# EAGLE design sensor_v9_ads (EAGLE 7.1.0)
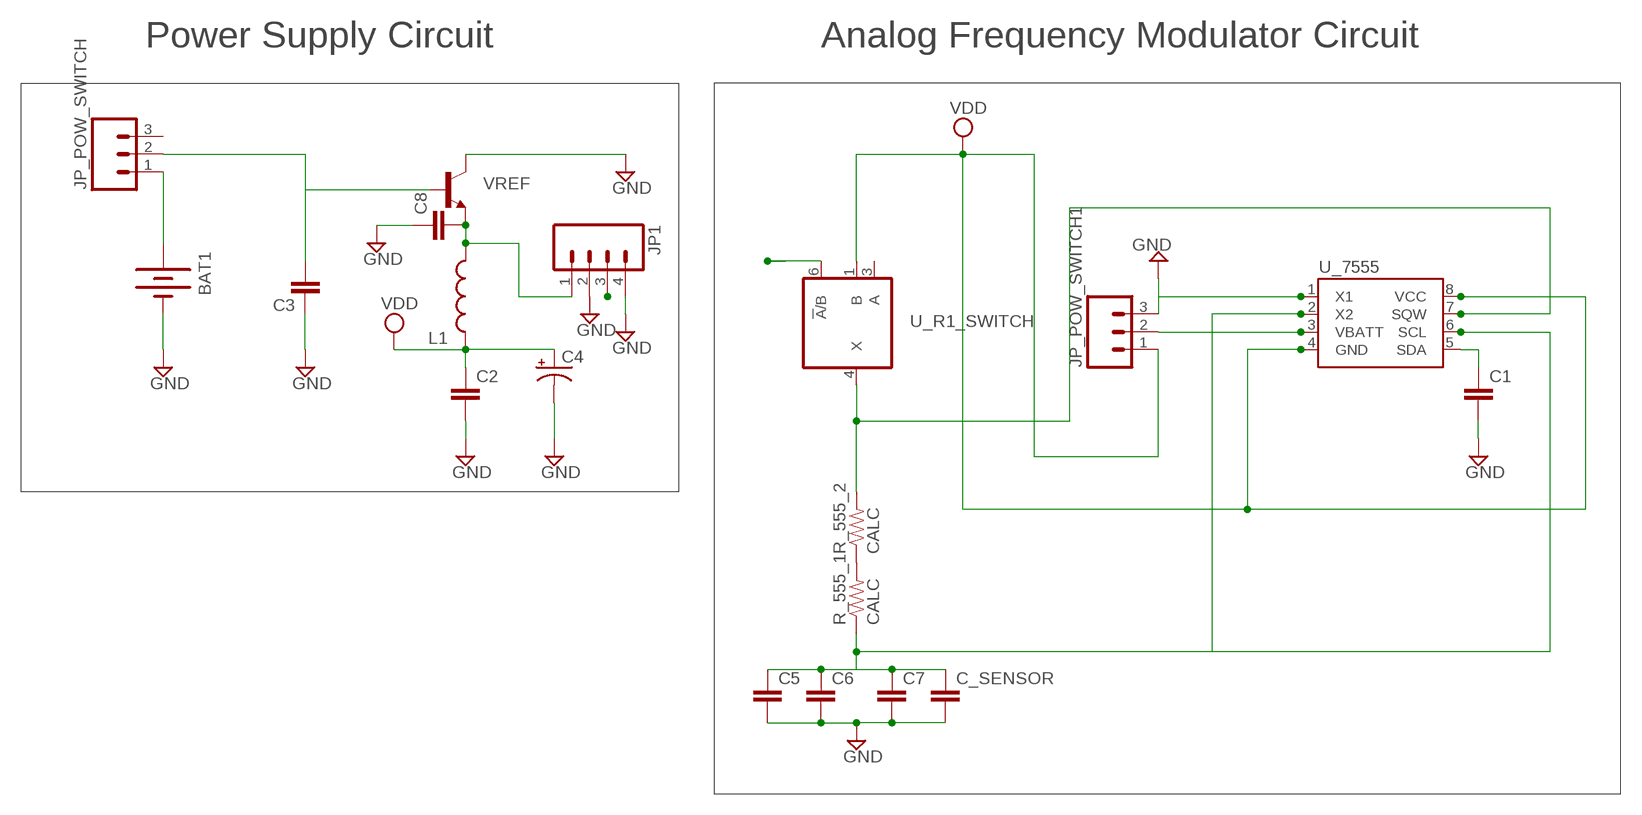
[diagram p0: schematic, sheet 1]

## Parts
BAT1  BATTERY20PTH_LAB  [BATTCOM_20MM_PTH]
C1  CAP0603-CAP  [0603-CAP]
C2  CAP0603-CAP  [0603-CAP]
C3  CAP0603-CAP  [0603-CAP]
C4  CAP_POL1206  [EIA3216]
C5  CAP0805  [0805]
C6  CAP0805  [0805]
C7  CAP0805  [0805]
C8  CAP0603-CAP  [0603-CAP]
C_SENSOR  CAP0805  [0805]
JP1  M04LOCK  [1X04_LOCK]
JP_POW_SWITCH  M03LOCK  [1X03_LOCK]
JP_POW_SWITCH1  M03LOCK  [1X03_LOCK]
L1  INDUCTOR0603  [0603]
R_555_1  CALC  RESISTOR0805-RES  [0805]
R_555_2  CALC  RESISTOR0805-RES  [0805]
U_7555  DS1307SO8  [SO08]
U_R1_SWITCH  741G3157DCKR  [DCK_R-PDSO-G6]
U_VREF  TRANSISTOR_NPNSOT23-3  [SOT23-3]

## Nets
FOUT: JP_POW_SWITCH1.2 U_7555.3(VBATT) U_R1_SWITCH.6(!A!/B)
GND: BAT1.2(-) C1.2 C2.2 C3.1 C4.C(-) C5.2 C6.2 C7.2 C8.1 C_SENSOR.2 JP1.2 JP1.4 JP_POW_SWITCH1.3 U_7555.1(X1) U_VREF.3(C)
N$6: BAT1.1(+) JP1.3 JP_POW_SWITCH.1
N$9: R_555_1.2 R_555_2.1
P2: C5.1 C6.1 C7.1 C_SENSOR.1 R_555_1.1 U_7555.2(X2) U_7555.6(SCL)
P5: C1.1 U_7555.5(SDA)
P7: R_555_2.2 U_7555.7(SQW) U_R1_SWITCH.4(X)
VDD: C2.1 C4.A(+) JP_POW_SWITCH1.1 L1.1 U_7555.4(GND) U_7555.8(VCC) U_R1_SWITCH.1(B)
VREFIN: C3.2 JP_POW_SWITCH.2 U_VREF.1(B)
VREFOUT: C8.2 JP1.1 L1.2 U_VREF.2(E)
Unconnected: JP_POW_SWITCH.3 U_R1_SWITCH.3(A)

## Notes on the sheet
- Power Supply Circuit | Analog Frequency Modulator Circuit
- VREF

## Power pins joined to a net without a drawn wire
GND: U_R1_SWITCH.2(GND)
VCC: U_R1_SWITCH.5(VCC)

## Library data of the parts
BAT1 = semipassiveTag_library:BATTERY: Battery Holders Various common sizes : AA, AAA, 20mm coin cell and 12mm coin cell.
C1-C3 C8 = SparkFun-Capacitors:CAP: Capacitor Standard 0603 ceramic capacitor, and 0.1" leaded capacitor.
C4 = SparkFun-Capacitors:CAP_POL: Capacitor Polarized These are standard SMD and PTH capacitors. Normally 10uF, 47uF, and 100uF in electrolytic and tantalum varieties. Always verify the external diameter of the through hole cap, it varies with capacity, voltage, and manufacturer. The EIA devices should be standard.
C5-C7 C_SENSOR = SparkFun:CAP: Capacitor Standard 0603 ceramic capacitor, and 0.1" leaded capacitor.
JP1 = SparkFun-Connectors:M04: Header 4 Standard 4-pin 0.1" header. Use with straight break away headers (SKU : PRT-00116), right angle break away headers (PRT-00553), swiss pins (PRT-00743), machine pins (PRT-00117), and female headers (PRT-00115). Molex polarized connector foot print use with SKU : PRT-08231 with associated crimp pins and housings. 1MM SMD Version SKU: PRT-10208
JP_POW_SWITCH JP_POW_SWITCH1 = SparkFun-Connectors:M03: Header 3 Standard 3-pin 0.1" header. Use with straight break away headers (SKU : PRT-00116), right angle break away headers (PRT-00553), swiss pins (PRT-00743), machine pins (PRT-00117), and female headers (PRT-00115). Molex polarized connector foot print use with SKU : PRT-08232 with associated crimp pins and housings.
L1 = SparkFun-Passives:INDUCTOR: Inductors Basic Inductor/Choke - 0603 and 1206. Footprints are not proven and vary greatly between part numbers.
R_555_1 R_555_2 = SparkFun-Resistors:RESISTOR: Resistor Basic schematic elements and footprints for 0603, 1206, and PTH resistors.
U_7555 = SparkFun-FreqCtrl:DS1307: I2C real-time clock with battery backup.
U_R1_SWITCH = 74xx-little-de:74*1G3157: Single-Pole, Double-Throw Analog Switch Source: http://focus.ti.com/lit/ds/symlink/sn74lvc1g3157.pdf
U_VREF = SparkFun:TRANSISTOR_NPN: Transistor NPN BJT configuration in SOT23 package. MMBT2222 is the common NPN we use. Double check BCE configuration again layout.

## Board
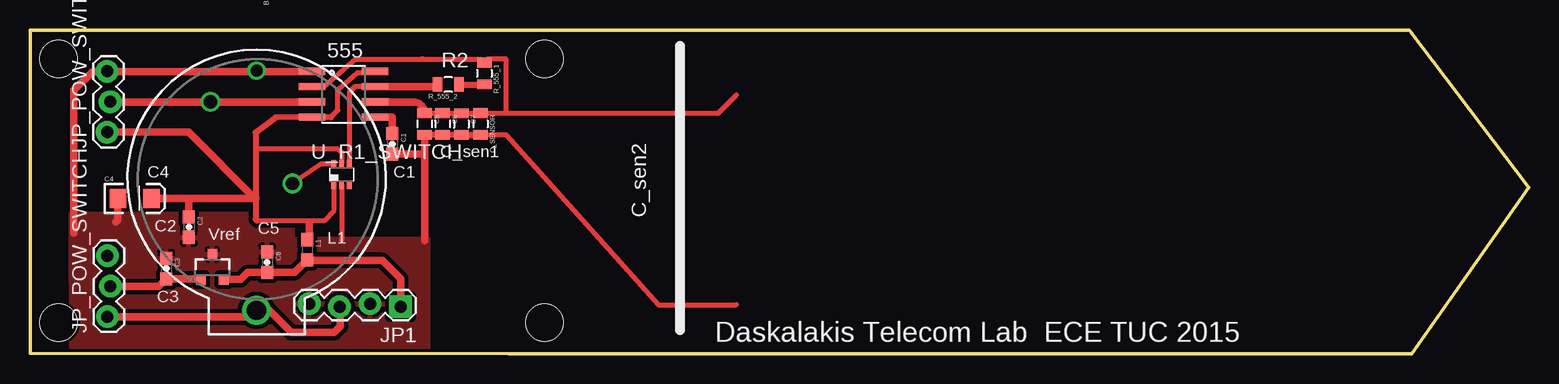
[diagram p1: board, top side]
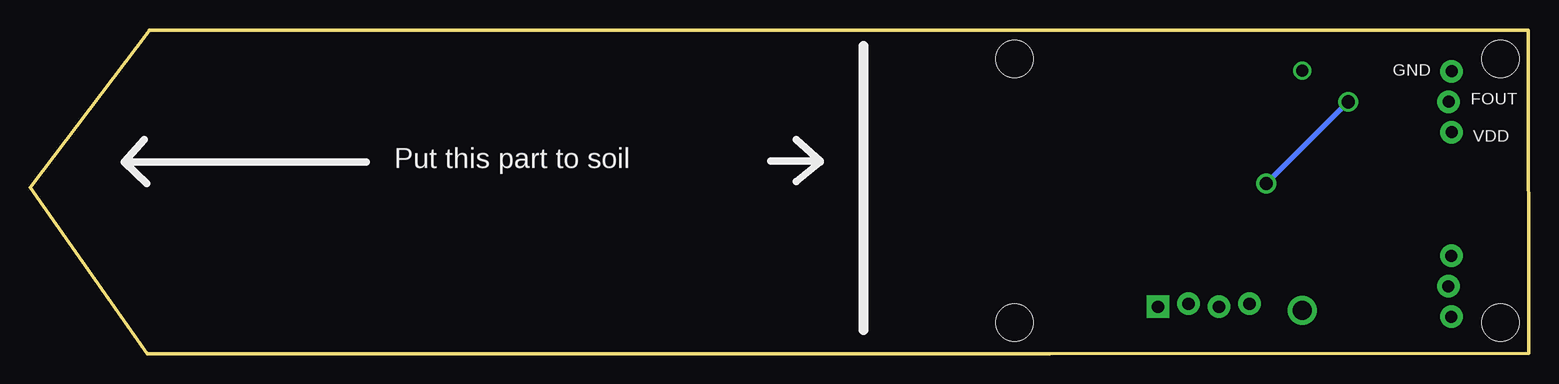
[diagram p2: board, bottom side, seen from below]

Size 124.9 x 27.03 mm. Coordinates in mm from the lower left corner, seen from the top.
Outline: 114.96,26.98 124.9,13.87 115.13,0.02
Outline: 0.03,27.02 0,0.08
Outline: 114.95,27.02 0.08,27.03
Outline: 0.02,0.05 39.9,0.01 115.04,0
Copper layers (1*16): Top 0.035mm / dielectric 1.5mm / Bottom 0.035mm
Design rules "Fusion_eagle_rule_v1.1 *": minimum track width 12mil, minimum drill 12mil, track to track 14mil, track to pad 14mil, pad to pad 14mil, via to via 14mil, smd to smd 0mil, copper to edge 10mil, drill to drill 10mil, minimum pad ring 10mil, minimum via ring 6mil, stop-mask expansion 2mil, vias tented up to drill 100mil, thermal gap 10mil
Holes 3.1 mm at 42.86,2.6 42.86,24.6 2.36,2.6 2.36,24.6

### Footprints (pad centres in the part's own frame; a part is rotated, then mirrored left to right if it is on the bottom)
BATTCOM_20MM_PTH = drill 1.6: 1 19.99,0 | drill 1: 2 0,0
0603-CAP = smd 1.1 x 1: 1 -0.85,0; 2 0.85,0
EIA3216 = smd 1.4 x 1.6: A 1.4,0; C -1.4,0
0805 = smd 0.8 x 1.2: 1 -0.9,0; 2 0.9,0
1X04_LOCK = drill 1.016 pad 1.88 square: 1 0,0.127 | drill 1.016 pad 1.88: 2 2.54,-0.127; 3 5.08,0.127; 4 7.62,-0.127
1X03_LOCK = drill 1 pad 1.88: 1 0,0.127; 2 2.54,-0.127; 3 5.08,0.127
0603 = smd 1.1 x 1: 1 -0.85,0; 2 0.85,0
SO08 = smd 0.61 x 2.21: 1 -1.905,-2.616; 2 -0.635,-2.616; 3 0.635,-2.616; 4 1.905,-2.616; 5 1.905,2.616; 6 0.635,2.616; 7 -0.635,2.616; 8 -1.905,2.616
DCK_R-PDSO-G6 = smd 0.4 x 0.7: 1 -0.65,-0.85; 2 0,-0.85; 3 0.65,-0.85; 4 0.65,0.85; 5 0,0.85; 6 -0.65,0.85
SOT23-3 = smd 0.8 x 0.9: 1 -0.95,-1; 2 0.95,-1; 3 0,1.1

### Placement (x,y rotation side)
BAT1  18.88,23.62 270 top
C1  30.19,17.53 270 top
C2  13.24,10.59 270 top
C3  11.34,7.12 270 top
C4  8.73,12.98 0 top
C5  32.89,19.19 270 top
C6  34.39,19.19 270 top
C7  35.95,19.18 270 top
C8  19.76,7.65 270 top
C_SENSOR  37.54,19.19 270 top
JP1  30.89,4.06 180 top
JP_POW_SWITCH  6.57,3.1 90 top
JP_POW_SWITCH1  6.56,18.5 90 top
L1  23.09,8.68 270 top
R_555_1  37.86,23.4 270 top
R_555_2  34.86,22.48 180 top
U_7555  26.13,21.66 270 top
U_R1_SWITCH  25.96,14.98 0 top
U_VREF  15.2,7.2 0 top

### Tracks (layer width: path | path; a pad name or v marks a point on that pad's centre or on a via)
FOUT  (via drill 1.1)
  Top 0.4: U_R1_SWITCH.6 24.24,15.83 v21.87,14.23
  Top 0.406: JP_POW_SWITCH1.2 6.56,21.04
  Top 0.61: 23.5,21.02 arc45 U_7555.3 v15.05,21.03 6.69,21.03 JP_POW_SWITCH1.2
  Bottom 0.406: v21.87,14.23 v15.06,21.04 v15.06,21.03 v15.05,21.03
GND
  Top 0.406: C5.2 35.36,18.29 | 37.46,18.3 36.66,18.3 | C_SENSOR.2 37.47,18.29 37.46,18.3 | 37.46,18.3 39.66,18.3 52.36,4.1 58.86,4.1 | U_R1_SWITCH.2 25.96,9.5 | 18.93,23.57 BAT1.2 | 6.45,23.57 6.43,23.57 JP_POW_SWITCH1.3
  Top 0.5: C5.2 C6.2 35.36,18.29 C7.2 C_SENSOR.2
  Top 0.61: C5.2 32.89,16.3 | 32.89,16.3 32.9,9.47 | U_7555.1 18.93,23.57 6.45,23.57 5.23,23.57 3.66,22 3.66,10.1 | C1.2 32.89,16.68 32.89,16.3 | C4.C 7.33,11.17 7.16,11
  pour Top: 3.42,11.68 21.82,11.68 21.86,9.6 33.16,9.6 33.16,0 3.46,0.1
N$4
  Top 0.406: 18.79,17.09 18.79,17.08 25.68,17.08 25.96,16.8 25.96,15.9
N$6
  Top 0.61: 18.88,3.6 BAT1.1 | BAT1.1 19.93,3.63 21.76,1.8 25.36,1.8 25.86,2.3 25.86,3.88 JP1.3 | JP_POW_SWITCH.1 18.34,3.1 BAT1.1
N$9
  Top 0.5: R_555_2.1 37.86,22.48 R_555_1.2
N$10
  Top 0.406: 37.86,20.1 57.36,20.1 58.86,21.6
P2
  Top 0.406: 23.59,22.27 23.46,22.27 U_7555.2 24.48,22.27 27.16,24.58 32.86,24.58 | 32.86,24.58 32.56,24.59 | C5.1 C6.1 C7.1 35.95,20.1 | 32.86,24.58 37.58,24.58 R_555_1.1 38.16,24.6 39.66,24.6 39.66,20.09 C_SENSOR.1 35.95,20.1 | 35.41,20.1 35.95,20.1
  Top 0.6: 31.95,21.03 arc-90 C5.1
  Top 0.61: U_7555.6 31.95,21.03
P5
  Top 0.406: U_7555.5 29.49,19.76
  Top 0.61: 29.49,19.76 30.19,19.76 C1.1
P7
  Top 0.406: U_7555.7 27.06,22.3 26.61,21.85 U_R1_SWITCH.4
  Top 0.61: U_7555.7 33.96,22.3 R_555_2.2
VDD
  Top 0.4: 27.26,23.46 28.05,23.46 28.05,23.54
  Top 0.406: U_7555.4 25.07,19.76 25.65,20.34 25.65,22.06 27.26,23.46 | 28.05,23.54 U_7555.8 | 18.64,12.98 18.68,12.93 | U_R1_SWITCH.1 25.31,11.91 24.51,11.11 23.16,11.11 | 23.16,11.11 18.93,11.11 | 23.26,11.01 23.16,11.11
  Top 0.5: 18.81,13.06 18.81,18.48 20.47,19.74 25.07,19.76 | 18.81,12.9 18.81,11.23 18.93,11.11
  Top 0.61: 18.68,12.93 18.81,13.06 18.81,12.95 | 23.26,9.53 L1.1 23.26,9.7 23.26,11.01 | C4.A 13.36,12.98 | 13.36,12.98 18.64,12.98 | C2.1 13.24,12.86 13.36,12.98 | JP_POW_SWITCH1.1 13.21,18.5 18.74,12.97 18.76,12.95 | 18.76,12.95 18.81,12.9 | 18.81,12.95 18.76,12.9 | 18.81,12.95 18.76,12.95
VREFIN
  Top 0.61: U_VREF.1 14.25,6.26 C3.2 10.72,5.64 JP_POW_SWITCH.2
VREFOUT
  Top 0.61: U_VREF.2 17.56,6.2 18.16,6.8 C8.2 22.06,6.8 L1.2 23.12,7.8 29.36,7.8 30.89,6.27 JP1.1

### Text on the board
tPlace: 555 | R2 | C_sen1 | C4 | C1 | C_sen2 | C2 | Vref | C5 | L1 | C3 | Daskalakis Telecom Lab ECE TUC 2015
bPlace: GND | FOUT | VDD | Put this part to soil